# Altium schematic sheet LM61495Q3_PINOUT.SchDoc
size A4; SheetNumber: 10; SheetTotal: 12
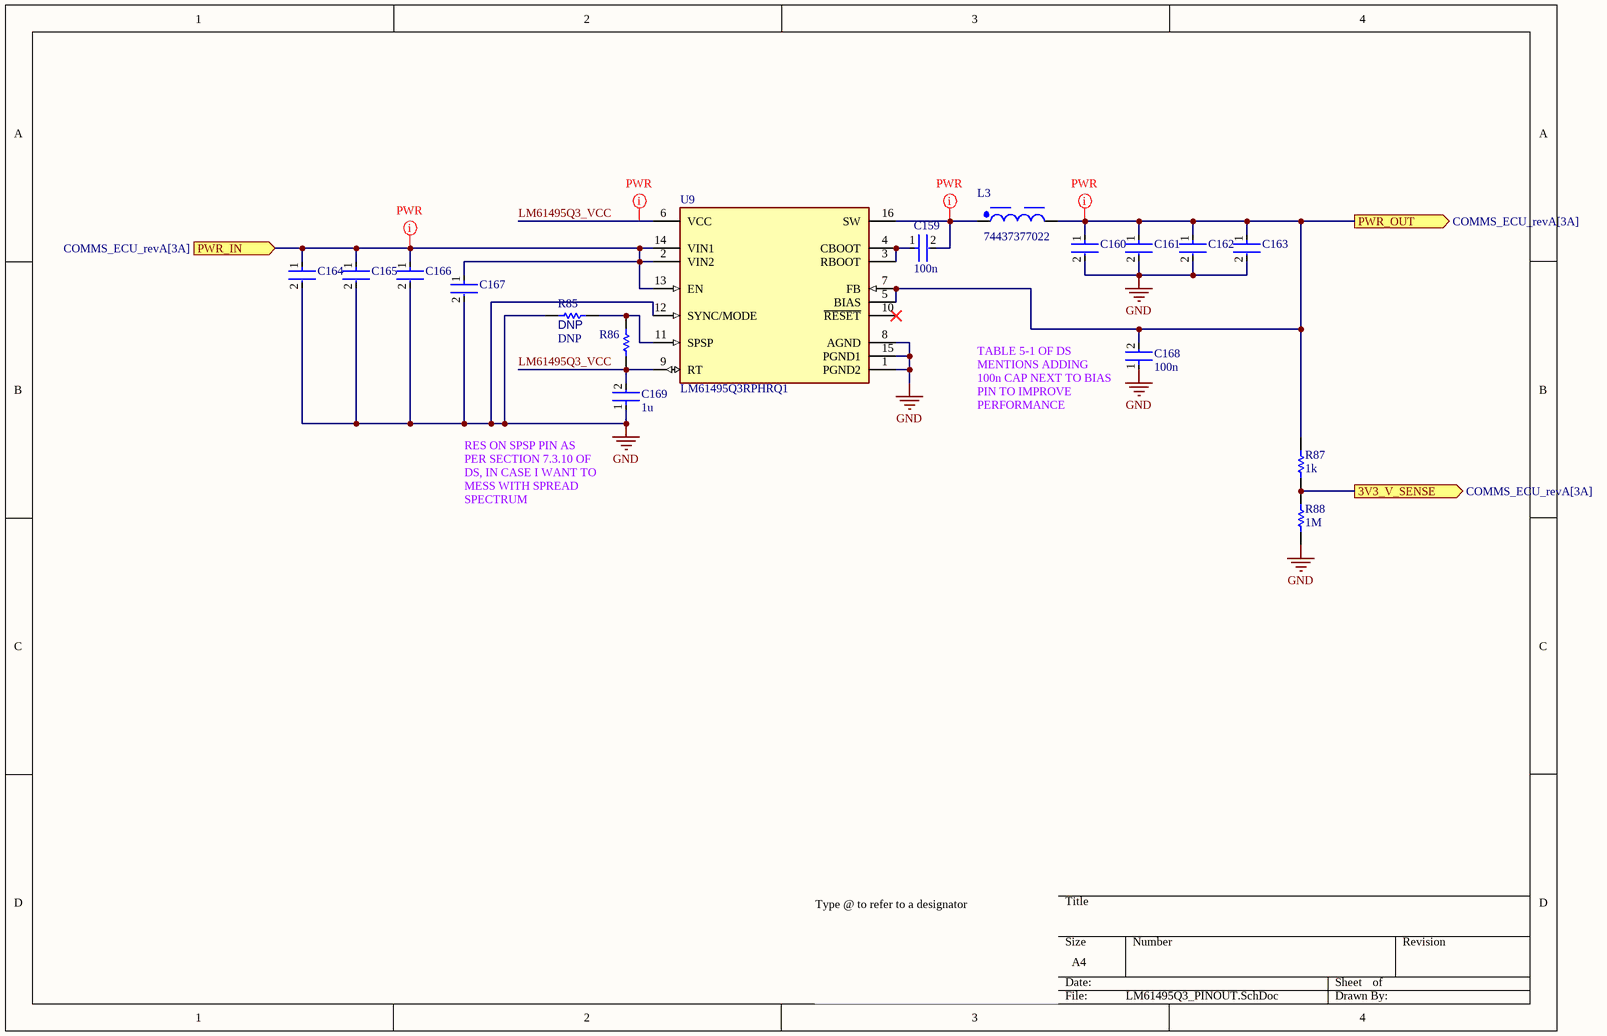
[diagram p0: LM61495Q3_PINOUT.SchDoc]

## Parts
C159  100n  [FP-0402-L_1_0_0_05-W_0_5-IPC_A]
C160  GRM32ER61C476KE15L  [FP-GRM32E-0_3-0_2-IPC_C]  (value not drawn)
C161  GRM32ER61C476KE15L  [FP-GRM32E-0_3-0_2-IPC_C]  (value not drawn)
C162  GRM32ER61C476KE15L  [FP-GRM32E-0_3-0_2-IPC_C]  (value not drawn)
C163  DNP  [FP-GRM32E-0_3-0_2-IPC_C]  (value not drawn)
C164  C3225X7R1H106M250AC  [FP-C3225-250-0_4-MFG]  (value not drawn)
C165  C3225X7R1H106M250AC  [FP-C3225-250-0_4-MFG]  (value not drawn)
C166  08055C474J4Z2A  [FP-0805-L_2_01_0_2-W_1_25-IPC_B]  (value not drawn)
C167  08055C474J4Z2A  [FP-0805-L_2_01_0_2-W_1_25-IPC_B]  (value not drawn)
C168  100n  [FP-0402-L_1_0_0_05-W_0_5-IPC_A]
C169  1u  [FP-0402-L_1_0_0_05-W_0_5-IPC_A]
L3  74437377022  [WE-LHMI_1335]
R85  DNP  [R0603B]
R86  0402 JUMPER  [RESC1005X40X25ML05T05]  (value not drawn)
R87  1k  [R0603B]
R88  1M  [R0603B]
U9  LM61495Q3RPHRQ1  [FP-RPH0016A-MFG]

## Ports
3V3_V_SENSE (out, see COMMS_ECU_revA[3A]), PWR_IN (in, see COMMS_ECU_revA[3A]), PWR_OUT (out, see COMMS_ECU_revA[3A])

## Nets
GND: C160.2 C161.2 C162.2 C163.2 C164.2 C165.2 C166.2 C167.2 C168.1 C169.1 R85.2 R88.1 U9.1(PGND2) U9.8(AGND) U9.12(SYNC/MODE) U9.15(PGND1)
3V3_V_SENSE: R87.1 R88.2 ; port 3V3_V_SENSE
LM61495Q3_VCC: C169.2 R86.1 U9.6(VCC) U9.9(RT)
PWR_IN: C164.1 C165.1 C166.1 C167.1 U9.2(VIN2) U9.13(EN) U9.14(VIN1) ; port PWR_IN
PWR_OUT: C160.1 C161.1 C162.1 C163.1 C168.2 L3.2 R87.2 U9.5(BIAS) U9.7(FB) ; port PWR_OUT
NetC159_1: C159.1 U9.3(RBOOT) U9.4(CBOOT)
NetC159_2: C159.2 L3.1 U9.16(SW)
NetR85_1: R85.1 R86.2 U9.11(SPSP)

Not connected (* = marked no-connect by the designer): U9 10(~{RESET})*

## Layout directives
net class PWR: LM61495Q3_VCC, NetC159_2, PWR_IN, PWR_OUT

## Notes on the sheet
- (near C168) TABLE 5-1 OF DS MENTIONS ADDING 100n CAP NEXT TO BIAS PIN TO IMPROVE PERFORMANCE
- (near C169) RES ON SPSP PIN AS PER SECTION 7.3.10 OF DS, IN CASE I WANT TO MESS WITH SPREAD SPECTRUM
- Type @ to refer to a designator

## Library data of the parts
C159 C168 C169 = CMP-001-00058-1: LARGE PADS, 0402 CAP, CHANGE COMMENT TO MATCH REAL P/N; Capacitor Type: Ceramic; Min Operating Temperature: -55°C; Mounting Technology: Surface Mount; Pins: 2; Case/Package: 0402; RoHS Compliant: Yes; Max Operating Temperature: 85°C
C160-C163 = CMP-2000-06362-2: CAP CER 47UF 16V X5R 1210; Tolerance: 10%; Material: Ceramic; Case Code (Metric): 3225; RoHS Compliant: Yes; Min Operating Temperature: -55°C; Radiation Hardening: No; Voltage: 16V; Package Quantity: 1; Case Code (Imperial): 1210; REACH SVHC: No SVHC; Capacitance: 47uF; Voltage Rating (DC): 16V; Dielectric: X5R; Case/Package: 1210; Length: 3.2mm; Voltage Rating: 16V; Packaging: Cut Tape; Width: 0.098inch; Number of Pins: 2; Lead Free: Lead Free; Height: 2.5mm; Mount: Surface Mount; Termination: SMD/SMT; Max Operating Temperature: 85°C; Thickness: 0.106inch; Depth: 2.5mm
C164 C165 = CMP-08246-002653-1: Multilayer Ceramic Capacitors 10uF ±20% 50V X7R SMD 1210; Width: 0.098inch; Package Quantity: 1000; Height: 2.5mm; Dielectric Material: Ceramic; Voltage Rating: 50V; Series: C; Capacitance: 10uF; Tolerance: 20%; Weight: 0.000564oz; Case/Package: 1210; Case Code (Imperial): 1210; Dielectric: X7R; Case Code (Metric): 3225; REACH SVHC: No SVHC; Packaging: Tape and Reel; Length: 0.126inch; Termination: SMD/SMT; Min Operating Temperature: -55°C; Voltage Rating (DC): 50V; Lead Free: Lead Free; Max Operating Temperature: 125°C; Thickness: 0.11inch; Mount: Surface Mount
C166 C167 = CMP-04427-003155-1: Automotive Ceramic Capacitor, 0805, 470nF, 5%, X7R, 15%, 50V; Dielectric: X7R; Depth: 1.25mm; Max Operating Temperature: 125°C; Mount: Surface Mount; Radiation Hardening: No; Capacitance: 470nF; Construction: Flat; Packaging: Tape and Reel; Min Operating Temperature: -55°C; Length: 2.01mm; RoHS Compliant: Yes; Voltage Rating (DC): 50V; Case/Package: 0805; Tolerance: 5%; Package Quantity: 2000
L3 = CMP-1353-00019-6: Inductor Power Shielded/Molded Wirewound 2.2uH 20% 100KHz Powdered Iron 10A 0.008Ohm DCR T/R Automotive AEC-Q200; Series Resistance: 8mΩ; DC Resistance (DCR): 7.2mΩ; Inductance: 2.2µH; Saturation Current: 14.2A; Core Material: Composite, Ferrite; Frequency: 22MHz; Mount: Surface Mount; Ambient Temperature Range Low: -40°C; Max DC Current: 10A; Depth: 12.6mm; Height: 3.3mm; Tolerance: 20%; REACH SVHC: Unknown; Width: 12.6mm; Max Operating Temperature: 125°C; Height - Seated (Max): 3.5052mm; Composition: Wirewound; Inductance Tolerance: 20%; Length: 13.5mm; RMS Current (Irms): 10A; Termination: SMD/SMT; Test Frequency: 100kHz; Current Rating: 10A; Case/Package: Nonstandard; Shielding: Shielded; Ambient Temperature Range High: 85°C; Min Operating Temperature: -40°C; Self Resonant Frequency: 22MHz; RoHS: Compliant
R85 R87 R88 = CMP-009-00002-14: Resistor
  R85: Value: DNP
  R87: Value: 1k
  R88: Value: 1M
R86 = CMP-009-00118-2: READ THE NAME; Pins: 2; Component Type: Standard; Design Item ID: CMP-009-00206-2; Source: 0402jump.SchLib
U9 = CMP-04918-000675-1: 10-A AUTOMOTIVE BUCK CONVERTER O